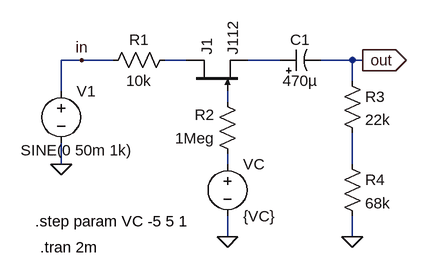
[diagram p0: schematic 02-j112_analog_switch.asc]
02-j112_analog_switch.asc, the LTspice schematic file:
Version 4
SHEET 1 880 680
WIRE -80 48 -112 48
WIRE -32 48 -80 48
WIRE 80 48 48 48
WIRE 224 48 176 48
WIRE 336 48 288 48
WIRE 352 48 336 48
WIRE 336 80 336 48
WIRE -112 96 -112 48
WIRE 144 112 144 96
WIRE -112 208 -112 176
WIRE 144 208 144 192
WIRE 336 208 336 160
WIRE 144 320 144 288
WIRE 336 320 336 288
FLAG 144 320 0
FLAG 336 320 0
FLAG -112 208 0
FLAG -80 48 in
FLAG 352 48 out
IOPIN 352 48 Out
SYMBOL njf 80 96 R270
SYMATTR InstName J1
SYMATTR Value J112
SYMBOL res 64 32 R90
WINDOW 0 0 56 VBottom 2
WINDOW 3 32 56 VTop 2
SYMATTR InstName R1
SYMATTR Value 10k
SYMBOL res 160 208 R180
WINDOW 0 36 76 Left 2
WINDOW 3 36 40 Left 2
SYMATTR InstName R2
SYMATTR Value 1Meg
SYMBOL res 320 64 R0
SYMATTR InstName R3
SYMATTR Value 22k
SYMBOL voltage -112 80 R0
WINDOW 3 -62 107 Left 2
WINDOW 123 0 0 Left 0
WINDOW 39 0 0 Left 0
SYMATTR Value SINE(0 50m 1k)
SYMATTR InstName V1
SYMBOL voltage 144 192 R0
WINDOW 123 0 0 Left 0
WINDOW 39 0 0 Left 0
SYMATTR InstName VC
SYMATTR Value {VC}
SYMBOL res 320 192 R0
SYMATTR InstName R4
SYMATTR Value 68k
SYMBOL polcap 224 64 R270
WINDOW 0 32 32 VTop 2
WINDOW 3 0 32 VBottom 2
SYMATTR InstName C1
SYMATTR Value 470µ
SYMATTR Description Capacitor
SYMATTR Type cap
SYMATTR SpiceLine V=63 Irms=800m Rser=0.081 Lser=0 mfg="Nichicon" pn="UPR1J471MRH" type="Al electrolytic"
TEXT -144 336 Left 2 !.tran 2m
TEXT -152 296 Left 2 !.step param VC -5 5 1

The netlist it stands for:
* 02-j112_analog_switch.asc
J1 N001 N003 N002 J112
R1 N001 in 10k
R2 N004 N003 1Meg
R3 out N005 22k
V1 in 0 SINE(0 50m 1k)
VC N004 0 {VC}
R4 N005 0 68k
C1 N002 out 470µ V=63 Irms=800m Rser=0.081 Lser=0 mfg="Nichicon" pn="UPR1J471MRH" type="Al electrolytic"
.model NJF NJF
.model PJF PJF
.lib standard.jft
.tran 2m
.step param VC -5 5 1
.backanno
.end